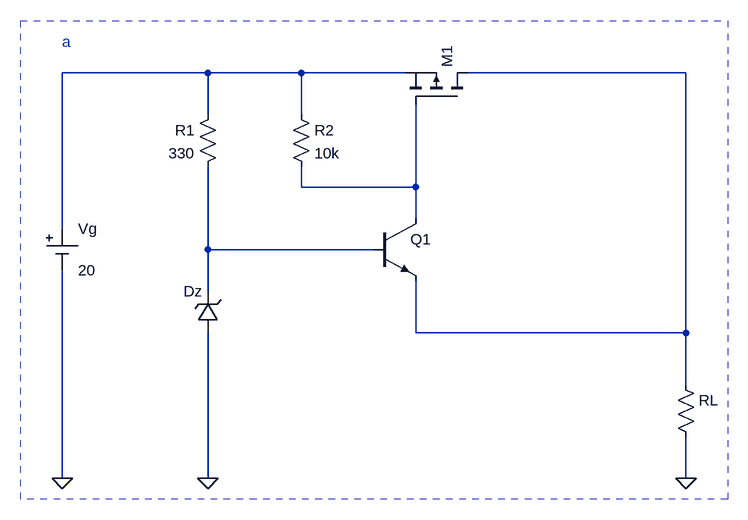
[diagram p0: schematic Ej 2.8a.asc]
Ej 2.8a.asc, the LTspice schematic file:
Version 4
SHEET 1 7772 18116
WIRE 4768 4016 4544 4016
WIRE 4912 4016 4768 4016
WIRE 5072 4016 4912 4016
WIRE 5504 4016 5168 4016
WIRE 4768 4080 4768 4016
WIRE 4912 4080 4912 4016
WIRE 4912 4192 4912 4160
WIRE 5088 4192 5088 4064
WIRE 5088 4192 4912 4192
WIRE 5088 4240 5088 4192
WIRE 4544 4256 4544 4016
WIRE 4768 4288 4768 4160
WIRE 5024 4288 4768 4288
WIRE 4768 4352 4768 4288
WIRE 5088 4416 5088 4336
WIRE 5504 4416 5504 4016
WIRE 5504 4416 5088 4416
WIRE 5504 4496 5504 4416
WIRE 4544 4640 4544 4320
WIRE 4768 4640 4768 4416
WIRE 5504 4640 5504 4576
FLAG 4544 4640 0
FLAG 5504 4640 0
FLAG 4768 4640 0
SYMBOL pmos 5168 4064 M270
WINDOW 3 56 72 Invisible 2
SYMATTR Value IRF9640
SYMATTR InstName M1
SYMBOL res 5488 4480 R0
WINDOW 3 36 76 Invisible 2
SYMATTR Value 10
SYMATTR InstName RL
SYMBOL zener 4784 4416 R180
WINDOW 0 24 64 Left 2
WINDOW 3 24 0 Invisible 2
SYMATTR InstName Dz
SYMATTR Value 1N750
SYMBOL npn 5024 4240 R0
WINDOW 3 56 68 Invisible 2
SYMATTR InstName Q1
SYMBOL res 4784 4064 M0
SYMATTR InstName R1
SYMATTR Value 330
SYMBOL res 4896 4064 R0
SYMATTR InstName R2
SYMATTR Value 10k
SYMBOL Misc\\cell 4544 4256 R0
WINDOW 123 0 0 Left 0
WINDOW 39 0 0 Left 0
SYMATTR InstName Vg
SYMATTR Value 20
TEXT 4544 3968 Left 2 ;a
RECTANGLE Normal 5568 4672 4480 3936 2

The netlist it stands for:
* Ej 2.8a.asc
M1 N002 N003 N001 N001 IRF9640
RL N002 0 10
Dz 0 N004 1N750
Q1 N003 N004 N002 0 NPN
R1 N001 N004 330
R2 N001 N003 10k
Vg N001 0 20
.model D D
.lib standard.dio
.model NPN NPN
.model PNP PNP
.lib standard.bjt
.model NMOS NMOS
.model PMOS PMOS
.lib standard.mos
* a
.backanno
.end